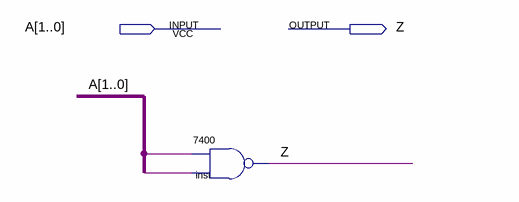
[diagram p0: schematic sheet]
// Quartus schematic nand_2in.bdf as structural Verilog: 1 symbols, 2 pins
module nand_2in (
  input  [1:0] A,
  output Z
);

  wire undriven, undriven_2;

  \7400  inst (.\3 (undriven_2), .\2 (undriven), .\1 (Z));
endmodule
